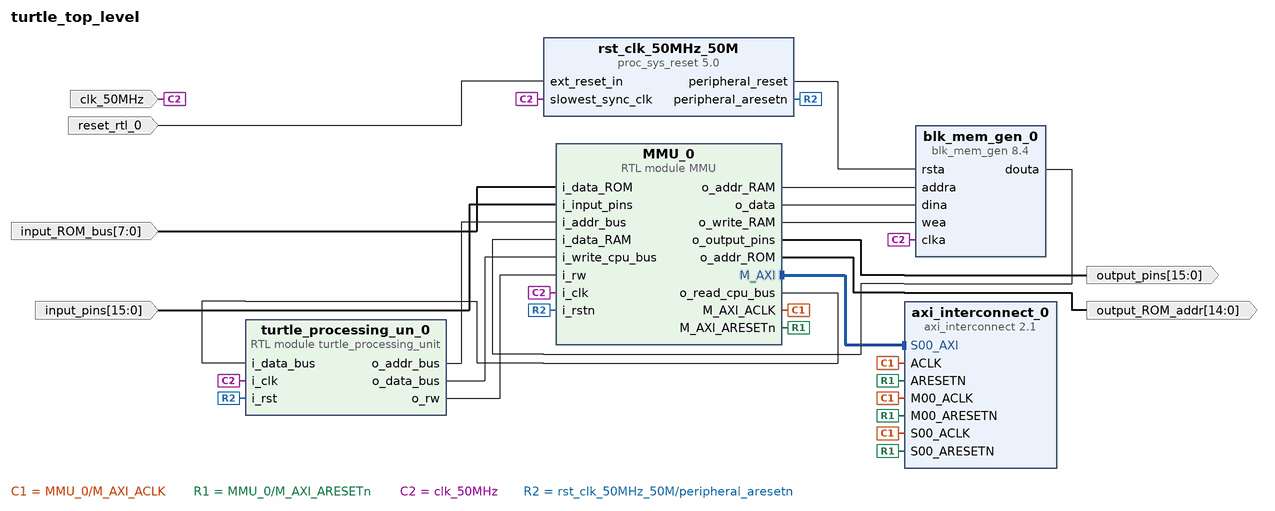
[diagram p0: block diagram of the top level]
# Vivado block design turtle_top_level, xc7a35tcpg236-1, Vivado 2024.1
create_bd_design turtle_top_level

create_bd_port -dir I -type clk clk_50MHz
set_property -dict {CONFIG.FREQ_HZ 50000000} [get_bd_ports clk_50MHz]
create_bd_port -dir I -type rst reset_rtl_0
set_property -dict {CONFIG.POLARITY ACTIVE_HIGH} [get_bd_ports reset_rtl_0]
create_bd_port -dir I -from 7 -to 0 -type data input_ROM_bus
create_bd_port -dir O -from 14 -to 0 -type data output_ROM_addr
create_bd_port -dir I -from 15 -to 0 -type data input_pins
create_bd_port -dir O -from 15 -to 0 -type data output_pins

create_bd_cell -type module -reference turtle_processing_unit turtle_processing_un_0
create_bd_cell -type ip -vlnv xilinx.com:ip:proc_sys_reset:5.0 rst_clk_50MHz_50M
create_bd_cell -type module -reference MMU MMU_0
create_bd_cell -type ip -vlnv xilinx.com:ip:blk_mem_gen:8.4 blk_mem_gen_0
set_property -dict [list \
  CONFIG.Enable_A Always_Enabled \
  CONFIG.Fill_Remaining_Memory_Locations true \
  CONFIG.Register_PortA_Output_of_Memory_Primitives false \
  CONFIG.Use_RSTA_Pin true \
  CONFIG.Write_Depth_A 32768 \
  CONFIG.Write_Width_A 8 \
  CONFIG.use_bram_block Stand_Alone \
] [get_bd_cells blk_mem_gen_0]
create_bd_cell -type ip -vlnv xilinx.com:ip:axi_interconnect:2.1 axi_interconnect_0
set_property -dict {CONFIG.NUM_MI 1} [get_bd_cells axi_interconnect_0]

# ---- connections ----

connect_bd_intf_net [get_bd_intf_pins MMU_0/M_AXI] [get_bd_intf_pins axi_interconnect_0/S00_AXI]
connect_bd_net -net ACLK_1 [get_bd_pins MMU_0/M_AXI_ACLK] \
  [get_bd_pins axi_interconnect_0/ACLK] [get_bd_pins axi_interconnect_0/S00_ACLK] [get_bd_pins axi_interconnect_0/M00_ACLK]
connect_bd_net [get_bd_pins MMU_0/M_AXI_ARESETn] \
  [get_bd_pins axi_interconnect_0/ARESETN] [get_bd_pins axi_interconnect_0/S00_ARESETN] \
  [get_bd_pins axi_interconnect_0/M00_ARESETN]
connect_bd_net [get_bd_pins MMU_0/o_addr_RAM] [get_bd_pins blk_mem_gen_0/addra]
connect_bd_net [get_bd_pins MMU_0/o_addr_ROM] [get_bd_ports output_ROM_addr]
connect_bd_net [get_bd_pins MMU_0/o_data] [get_bd_pins blk_mem_gen_0/dina]
connect_bd_net -net MMU_0_o_led_bar [get_bd_pins MMU_0/o_output_pins] [get_bd_ports output_pins]
connect_bd_net [get_bd_pins MMU_0/o_read_cpu_bus] [get_bd_pins turtle_processing_un_0/i_data_bus]
connect_bd_net [get_bd_pins MMU_0/o_write_RAM] [get_bd_pins blk_mem_gen_0/wea]
connect_bd_net [get_bd_pins blk_mem_gen_0/douta] [get_bd_pins MMU_0/i_data_RAM]
connect_bd_net [get_bd_ports clk_50MHz] \
  [get_bd_pins rst_clk_50MHz_50M/slowest_sync_clk] [get_bd_pins blk_mem_gen_0/clka] [get_bd_pins MMU_0/i_clk] \
  [get_bd_pins turtle_processing_un_0/i_clk]
connect_bd_net [get_bd_ports input_ROM_bus] [get_bd_pins MMU_0/i_data_ROM]
connect_bd_net [get_bd_ports input_pins] [get_bd_pins MMU_0/i_input_pins]
connect_bd_net -net reset_rtl_0_1 [get_bd_ports reset_rtl_0] [get_bd_pins rst_clk_50MHz_50M/ext_reset_in]
connect_bd_net [get_bd_pins rst_clk_50MHz_50M/peripheral_aresetn] [get_bd_pins MMU_0/i_rstn] [get_bd_pins turtle_processing_un_0/i_rst]
connect_bd_net [get_bd_pins rst_clk_50MHz_50M/peripheral_reset] [get_bd_pins blk_mem_gen_0/rsta]
connect_bd_net [get_bd_pins turtle_processing_un_0/o_addr_bus] [get_bd_pins MMU_0/i_addr_bus]
connect_bd_net [get_bd_pins turtle_processing_un_0/o_data_bus] [get_bd_pins MMU_0/i_write_cpu_bus]
connect_bd_net [get_bd_pins turtle_processing_un_0/o_rw] [get_bd_pins MMU_0/i_rw]

validate_bd_design
save_bd_design
